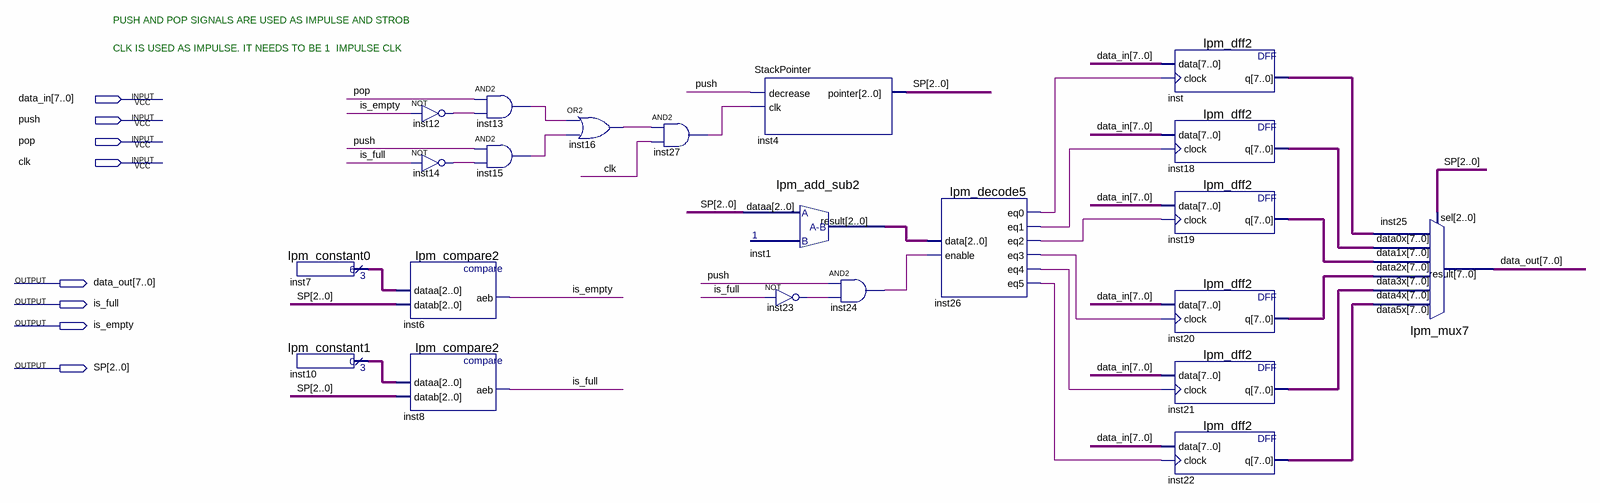
[diagram p0: schematic sheet]
// Quartus schematic Stack.bdf as structural Verilog: 22 symbols, 8 pins
module Stack (
  input  [7:0] data_in,
  input  push,
  input  pop,
  input  clk,
  output [7:0] data_out,
  output is_full,
  output is_empty,
  output [2:0] SP
);

  wire inst12_out, inst13_out, inst14_out, inst15_out, inst16_out, inst23_out, inst24_out, inst26_eq0,
       inst26_eq1, inst26_eq2, inst26_eq3, inst26_eq4, inst26_eq5, inst27_out;
  wire [2:0] inst1_result, inst7_result, inst10_result;
  wire [7:0] inst18_q, inst19_q, inst20_q, inst21_q, inst22_q, inst_q;

  lpm_constant0 inst7 (.result(inst7_result));
  lpm_constant1 inst10 (.result(inst10_result));
  not inst12 (inst12_out, is_empty);
  not inst14 (inst14_out, is_full);
  lpm_compare2 inst6 (.dataa(inst7_result), .datab(SP), .aeb(is_empty));
  lpm_compare2 inst8 (.dataa(inst10_result), .datab(SP), .aeb(is_full));
  and inst13 (inst13_out, pop, inst12_out);
  and inst15 (inst15_out, push, inst14_out);
  or inst16 (inst16_out, inst13_out, inst15_out);
  and inst27 (inst27_out, inst16_out, clk);
  StackPointer inst4 (.decrease(push), .clk(inst27_out), .pointer(SP));
  lpm_add_sub2 inst1 (.dataa(SP), .result(inst1_result));
  not inst23 (inst23_out, is_full);
  and inst24 (inst24_out, push, inst23_out);
  lpm_decode5 inst26 (
    .data(inst1_result), .enable(inst24_out), .eq0(inst26_eq0), .eq1(inst26_eq1), .eq2(inst26_eq2),
    .eq3(inst26_eq3), .eq4(inst26_eq4), .eq5(inst26_eq5));
  lpm_dff2 inst (.data(data_in), .clock(inst26_eq0), .q(inst_q));
  lpm_dff2 inst18 (.data(data_in), .clock(inst26_eq1), .q(inst18_q));
  lpm_dff2 inst19 (.data(data_in), .clock(inst26_eq2), .q(inst19_q));
  lpm_dff2 inst20 (.data(data_in), .clock(inst26_eq3), .q(inst20_q));
  lpm_dff2 inst21 (.data(data_in), .clock(inst26_eq4), .q(inst21_q));
  lpm_dff2 inst22 (.data(data_in), .clock(inst26_eq5), .q(inst22_q));
  lpm_mux7 inst25 (
    .data5x(inst22_q), .data4x(inst21_q), .data3x(inst20_q), .data2x(inst19_q), .data1x(inst18_q),
    .data0x(inst_q), .sel(SP), .result(data_out));

  // Notes on the sheet:
  //   PUSH AND POP SIGNALS ARE USED AS IMPULSE AND STROB
  //   CLK IS USED AS IMPULSE. IT NEEDS TO BE 1  IMPULSE CLK
endmodule
